# Altium schematic sheet FMC_connector_AB.SchDoc: FMC Connector AB
size A; Author: James Thomas; CompanyName: BYUI; DrawnBy: James Thomas; Engineer: James Thomas; Organization: CSEE; DocumentNumber: 6; Revision: 0.0.1; SheetNumber: 6; SheetTotal: 15
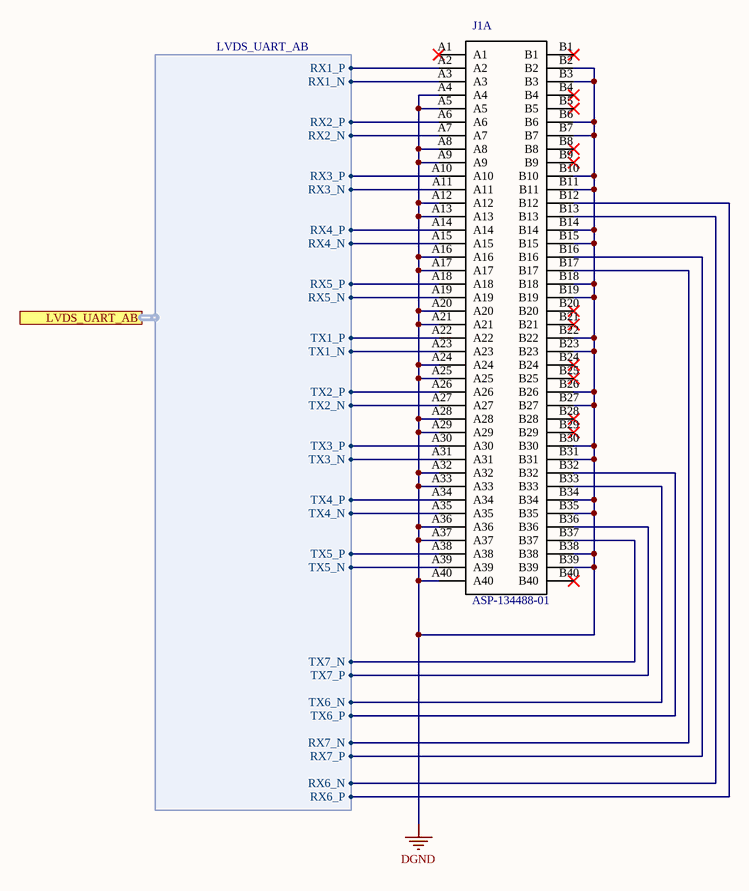
[diagram p0: FMC_connector_AB.SchDoc]

## Parts
J1  ASP-134488-01  [*SAMTEC_ASP-134488-01_ASP-134488-01(Primary)]  (part A of 5)

## Ports
LVDS_UART_AB (harness LVDS_UART_AB)

## Harnesses
LVDS_UART_AB: RX1_P, RX1_N, RX2_P, RX2_N, RX3_P, RX3_N, RX4_P, RX4_N, RX5_P, RX5_N, TX1_P, TX1_N, TX2_P, TX2_N, TX3_P, TX3_N, TX4_P, TX4_N, TX5_P, TX5_N, TX6_P, TX6_N, TX7_P, TX7_N, RX7_P, RX7_N, RX6_P, RX6_N

## Nets
DGND: J1.A4 J1.A5 J1.A8 J1.A9 J1.A12 J1.A13 J1.A16 J1.A17 J1.A20 J1.A21 J1.A24 J1.A25 J1.A28 J1.A29 J1.A32 J1.A33 J1.A36 J1.A37 J1.A40 J1.B2 J1.B3 J1.B6 J1.B7 J1.B10 J1.B11 J1.B14 J1.B15 J1.B18 J1.B19 J1.B22 J1.B23 J1.B26 J1.B27 J1.B30 J1.B31 J1.B34 J1.B35 J1.B38 J1.B39
NetJ1_A2: J1.A2 ; port LVDS_UART_AB.RX1_P
NetJ1_A3: J1.A3 ; port LVDS_UART_AB.RX1_N
NetJ1_A6: J1.A6 ; port LVDS_UART_AB.RX2_P
NetJ1_A7: J1.A7 ; port LVDS_UART_AB.RX2_N
NetJ1_A10: J1.A10 ; port LVDS_UART_AB.RX3_P
NetJ1_A11: J1.A11 ; port LVDS_UART_AB.RX3_N
NetJ1_A14: J1.A14 ; port LVDS_UART_AB.RX4_P
NetJ1_A15: J1.A15 ; port LVDS_UART_AB.RX4_N
NetJ1_A18: J1.A18 ; port LVDS_UART_AB.RX5_P
NetJ1_A19: J1.A19 ; port LVDS_UART_AB.RX5_N
NetJ1_A22: J1.A22 ; port LVDS_UART_AB.TX1_P
NetJ1_A23: J1.A23 ; port LVDS_UART_AB.TX1_N
NetJ1_A26: J1.A26 ; port LVDS_UART_AB.TX2_P
NetJ1_A27: J1.A27 ; port LVDS_UART_AB.TX2_N
NetJ1_A30: J1.A30 ; port LVDS_UART_AB.TX3_P
NetJ1_A31: J1.A31 ; port LVDS_UART_AB.TX3_N
NetJ1_A34: J1.A34 ; port LVDS_UART_AB.TX4_P
NetJ1_A35: J1.A35 ; port LVDS_UART_AB.TX4_N
NetJ1_A38: J1.A38 ; port LVDS_UART_AB.TX5_P
NetJ1_A39: J1.A39 ; port LVDS_UART_AB.TX5_N
NetJ1_B12: J1.B12 ; port LVDS_UART_AB.RX6_P
NetJ1_B13: J1.B13 ; port LVDS_UART_AB.RX6_N
NetJ1_B16: J1.B16 ; port LVDS_UART_AB.RX7_P
NetJ1_B17: J1.B17 ; port LVDS_UART_AB.RX7_N
NetJ1_B32: J1.B32 ; port LVDS_UART_AB.TX6_P
NetJ1_B33: J1.B33 ; port LVDS_UART_AB.TX6_N
NetJ1_B36: J1.B36 ; port LVDS_UART_AB.TX7_P
NetJ1_B37: J1.B37 ; port LVDS_UART_AB.TX7_N

Not connected (* = marked no-connect by the designer): J1 A1* B1* B4* B5* B8* B9* B20* B21* B24* B25* B28* B29* B40*

## Library data of the parts
J1 = ASP-134488-01: SnapEDA_Link: https://www.snapeda.com/parts/ASP-134488-01/Samtec%20Inc./view-part/423215/?ref=snap; Value: *